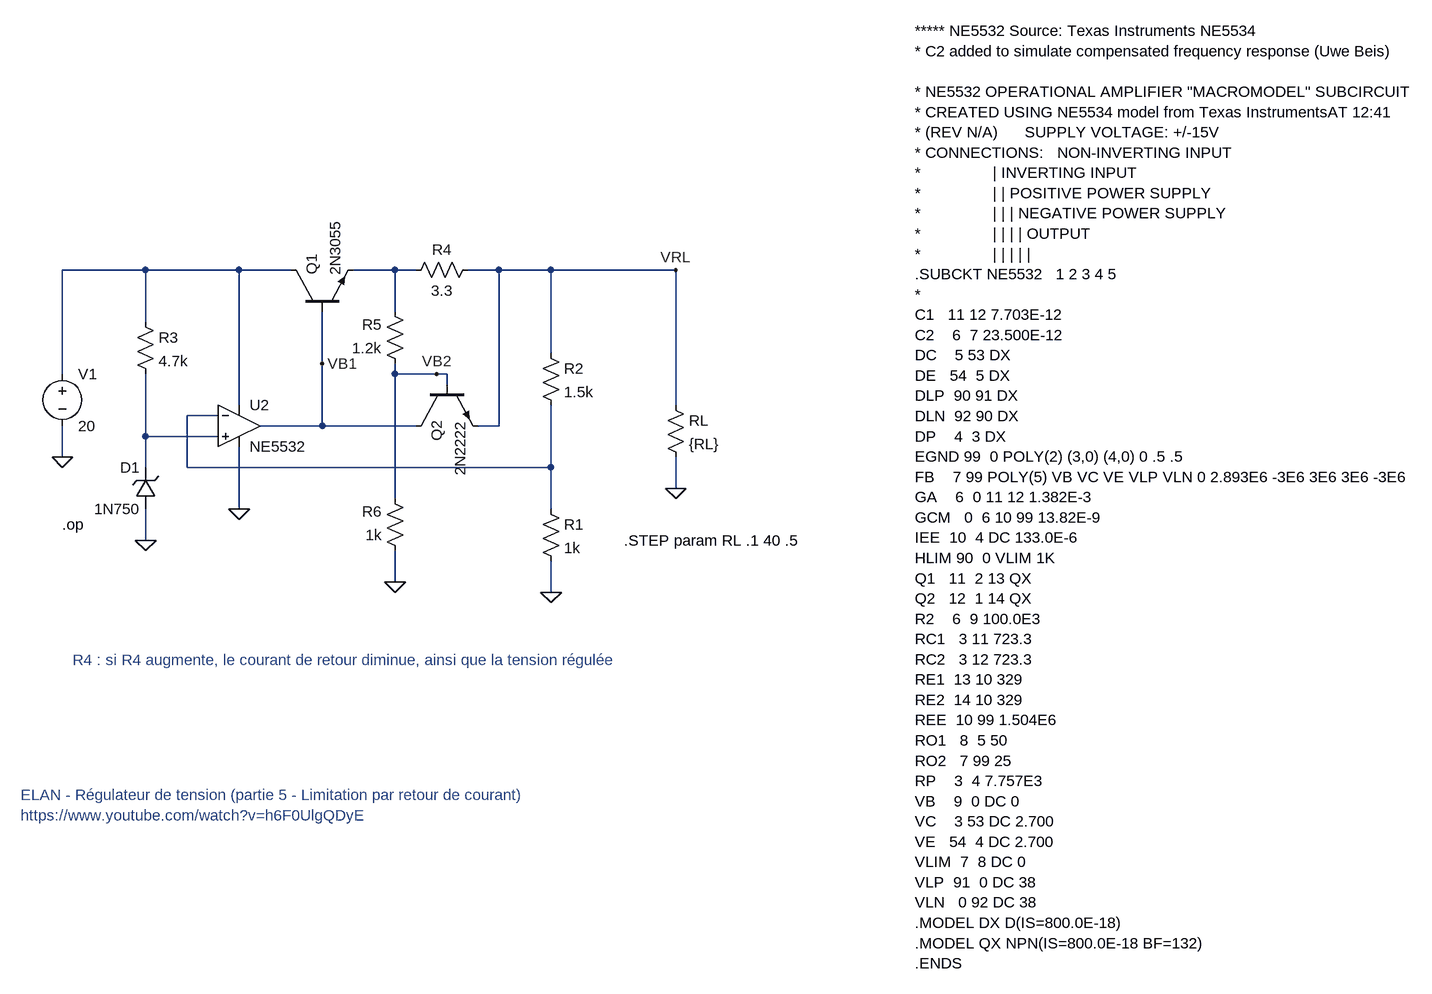
[diagram p0: schematic Foldback02.asc]
Foldback02.asc, the LTspice schematic file:
Version 4.1
SHEET 1 2108 920
WIRE 128 -16 0 -16
WIRE 272 -16 128 -16
WIRE 352 -16 272 -16
WIRE 512 -16 448 -16
WIRE 544 -16 512 -16
WIRE 672 -16 624 -16
WIRE 752 -16 672 -16
WIRE 944 -16 752 -16
WIRE 512 48 512 -16
WIRE 128 64 128 -16
WIRE 752 112 752 -16
WIRE 400 128 400 48
WIRE 0 144 0 -16
WIRE 512 144 512 128
WIRE 576 144 512 144
WIRE 592 144 576 144
WIRE 592 160 592 144
WIRE 272 192 272 -16
WIRE 944 192 944 -16
WIRE 240 208 192 208
WIRE 400 224 400 128
WIRE 400 224 304 224
WIRE 544 224 400 224
WIRE 672 224 672 -16
WIRE 672 224 640 224
WIRE 128 240 128 144
WIRE 240 240 128 240
WIRE 0 272 0 224
WIRE 128 288 128 240
WIRE 192 288 192 208
WIRE 752 288 752 192
WIRE 752 288 192 288
WIRE 944 320 944 272
WIRE 512 336 512 144
WIRE 272 352 272 256
WIRE 752 352 752 288
WIRE 128 400 128 352
WIRE 512 464 512 416
WIRE 752 480 752 432
FLAG 0 272 0
FLAG 128 400 0
FLAG 752 480 0
FLAG 944 320 0
FLAG 272 352 0
FLAG 512 464 0
FLAG 944 -16 VRL
FLAG 400 128 VB1
FLAG 576 144 VB2
SYMBOL voltage 0 128 R0
WINDOW 123 0 0 Left 0
WINDOW 39 0 0 Left 0
SYMATTR InstName V1
SYMATTR Value 20
SYMBOL npn 352 48 R270
SYMATTR InstName Q1
SYMATTR Value 2N3055
SYMBOL zener 144 352 R180
WINDOW 0 24 64 Left 2
WINDOW 3 24 0 Left 2
SYMATTR InstName D1
SYMATTR Value 1N750
SYMBOL res 112 48 R0
SYMATTR InstName R3
SYMATTR Value 4.7k
SYMBOL res 736 96 R0
SYMATTR InstName R2
SYMATTR Value 1.5k
SYMBOL res 736 336 R0
SYMATTR InstName R1
SYMATTR Value 1k
SYMBOL res 928 176 R0
SYMATTR InstName RL
SYMATTR Value {RL}
SYMBOL OpAmps\\opamp2 272 160 R0
SYMATTR InstName U2
SYMATTR Value NE5532
SYMBOL res 640 -32 R90
WINDOW 0 0 56 VBottom 2
WINDOW 3 32 56 VTop 2
SYMATTR InstName R4
SYMATTR Value 3.3
SYMBOL res 528 144 R180
WINDOW 0 36 76 Left 2
WINDOW 3 36 40 Left 2
SYMATTR InstName R5
SYMATTR Value 1.2k
SYMBOL res 528 432 R180
WINDOW 0 36 76 Left 2
WINDOW 3 36 40 Left 2
SYMATTR InstName R6
SYMATTR Value 1k
SYMBOL npn 544 160 M90
SYMATTR InstName Q2
SYMATTR Value 2N2222
TEXT 0 376 Left 2 !.op
TEXT 864 400 Left 2 !.STEP param RL .1 40 .5
TEXT 1312 -384 Left 2 !***** NE5532 Source: Texas Instruments NE5534\n* C2 added to simulate compensated frequency response (Uwe Beis)\n \n* NE5532 OPERATIONAL AMPLIFIER "MACROMODEL" SUBCIRCUIT\n* CREATED USING NE5534 model from Texas InstrumentsAT 12:41\n* (REV N/A)      SUPPLY VOLTAGE: +/-15V\n* CONNECTIONS:   NON-INVERTING INPUT\n*                | INVERTING INPUT\n*                | | POSITIVE POWER SUPPLY\n*                | | | NEGATIVE POWER SUPPLY\n*                | | | | OUTPUT\n*                | | | | |\n.SUBCKT NE5532   1 2 3 4 5\n*\nC1   11 12 7.703E-12\nC2    6  7 23.500E-12\nDC    5 53 DX\nDE   54  5 DX\nDLP  90 91 DX\nDLN  92 90 DX\nDP    4  3 DX\nEGND 99  0 POLY(2) (3,0) (4,0) 0 .5 .5\nFB    7 99 POLY(5) VB VC VE VLP VLN 0 2.893E6 -3E6 3E6 3E6 -3E6\nGA    6  0 11 12 1.382E-3\nGCM   0  6 10 99 13.82E-9\nIEE  10  4 DC 133.0E-6\nHLIM 90  0 VLIM 1K\nQ1   11  2 13 QX\nQ2   12  1 14 QX\nR2    6  9 100.0E3\nRC1   3 11 723.3\nRC2   3 12 723.3\nRE1  13 10 329\nRE2  14 10 329\nREE  10 99 1.504E6\nRO1   8  5 50\nRO2   7 99 25\nRP    3  4 7.757E3\nVB    9  0 DC 0\nVC    3 53 DC 2.700\nVE   54  4 DC 2.700\nVLIM  7  8 DC 0\nVLP  91  0 DC 38\nVLN   0 92 DC 38\n.MODEL DX D(IS=800.0E-18)\n.MODEL QX NPN(IS=800.0E-18 BF=132)\n.ENDS
TEXT -64 792 Left 2 ;ELAN - Régulateur de tension (partie 5 - Limitation par retour de courant)\nhttps://www.youtube.com/watch?v=h6F0UlgQDyE
TEXT 16 584 Left 2 ;R4 : si R4 augmente, le courant de retour diminue, ainsi que la tension régulée

The netlist it stands for:
* Foldback02.asc
V1 N001 0 20
Q1 N001 VB1 N002 0 2N3055
D1 0 N004 1N750
R3 N001 N004 4.7k
R2 VRL N003 1.5k
R1 N003 0 1k
RL VRL 0 {RL}
X§U2 N004 N003 N001 0 VB1 NE5532  ; pins In+ In- V+ V- OUT
R4 VRL N002 3.3
R5 VB2 N002 1.2k
R6 0 VB2 1k
Q2 VB1 VB2 VRL 0 2N2222
.model D D
.lib standard.dio
.model NPN NPN
.model PNP PNP
.lib standard.bjt
.op
.STEP param RL .1 40 .5
***** NE5532 Source: Texas Instruments NE5534
* C2 added to simulate compensated frequency response (Uwe Beis)
* NE5532 OPERATIONAL AMPLIFIER "MACROMODEL" SUBCIRCUIT
* CREATED USING NE5534 model from Texas InstrumentsAT 12:41
* (REV N/A)      SUPPLY VOLTAGE: +/-15V
* CONNECTIONS:   NON-INVERTING INPUT
*                | INVERTING INPUT
*                | | POSITIVE POWER SUPPLY
*                | | | NEGATIVE POWER SUPPLY
*                | | | | OUTPUT
*                | | | | |
.SUBCKT NE5532   1 2 3 4 5
*
C1   11 12 7.703E-12
C2    6  7 23.500E-12
DC    5 53 DX
DE   54  5 DX
DLP  90 91 DX
DLN  92 90 DX
DP    4  3 DX
EGND 99  0 POLY(2) (3,0) (4,0) 0 .5 .5
FB    7 99 POLY(5) VB VC VE VLP VLN 0 2.893E6 -3E6 3E6 3E6 -3E6
GA    6  0 11 12 1.382E-3
GCM   0  6 10 99 13.82E-9
IEE  10  4 DC 133.0E-6
HLIM 90  0 VLIM 1K
Q1   11  2 13 QX
Q2   12  1 14 QX
R2    6  9 100.0E3
RC1   3 11 723.3
RC2   3 12 723.3
RE1  13 10 329
RE2  14 10 329
REE  10 99 1.504E6
RO1   8  5 50
RO2   7 99 25
RP    3  4 7.757E3
VB    9  0 DC 0
VC    3 53 DC 2.700
VE   54  4 DC 2.700
VLIM  7  8 DC 0
VLP  91  0 DC 38
VLN   0 92 DC 38
.MODEL DX D(IS=800.0E-18)
.MODEL QX NPN(IS=800.0E-18 BF=132)
.ENDS
* ELAN - Régulateur de tension (partie 5 - Limitation par retour de courant)
* https://www.youtube.com/watch?v=h6F0UlgQDyE
* R4 : si R4 augmente, le courant de retour diminue, ainsi que la tension régulée
.backanno
.end